# Altium schematic sheet ECG_NEMO_final.schdoc
size A2
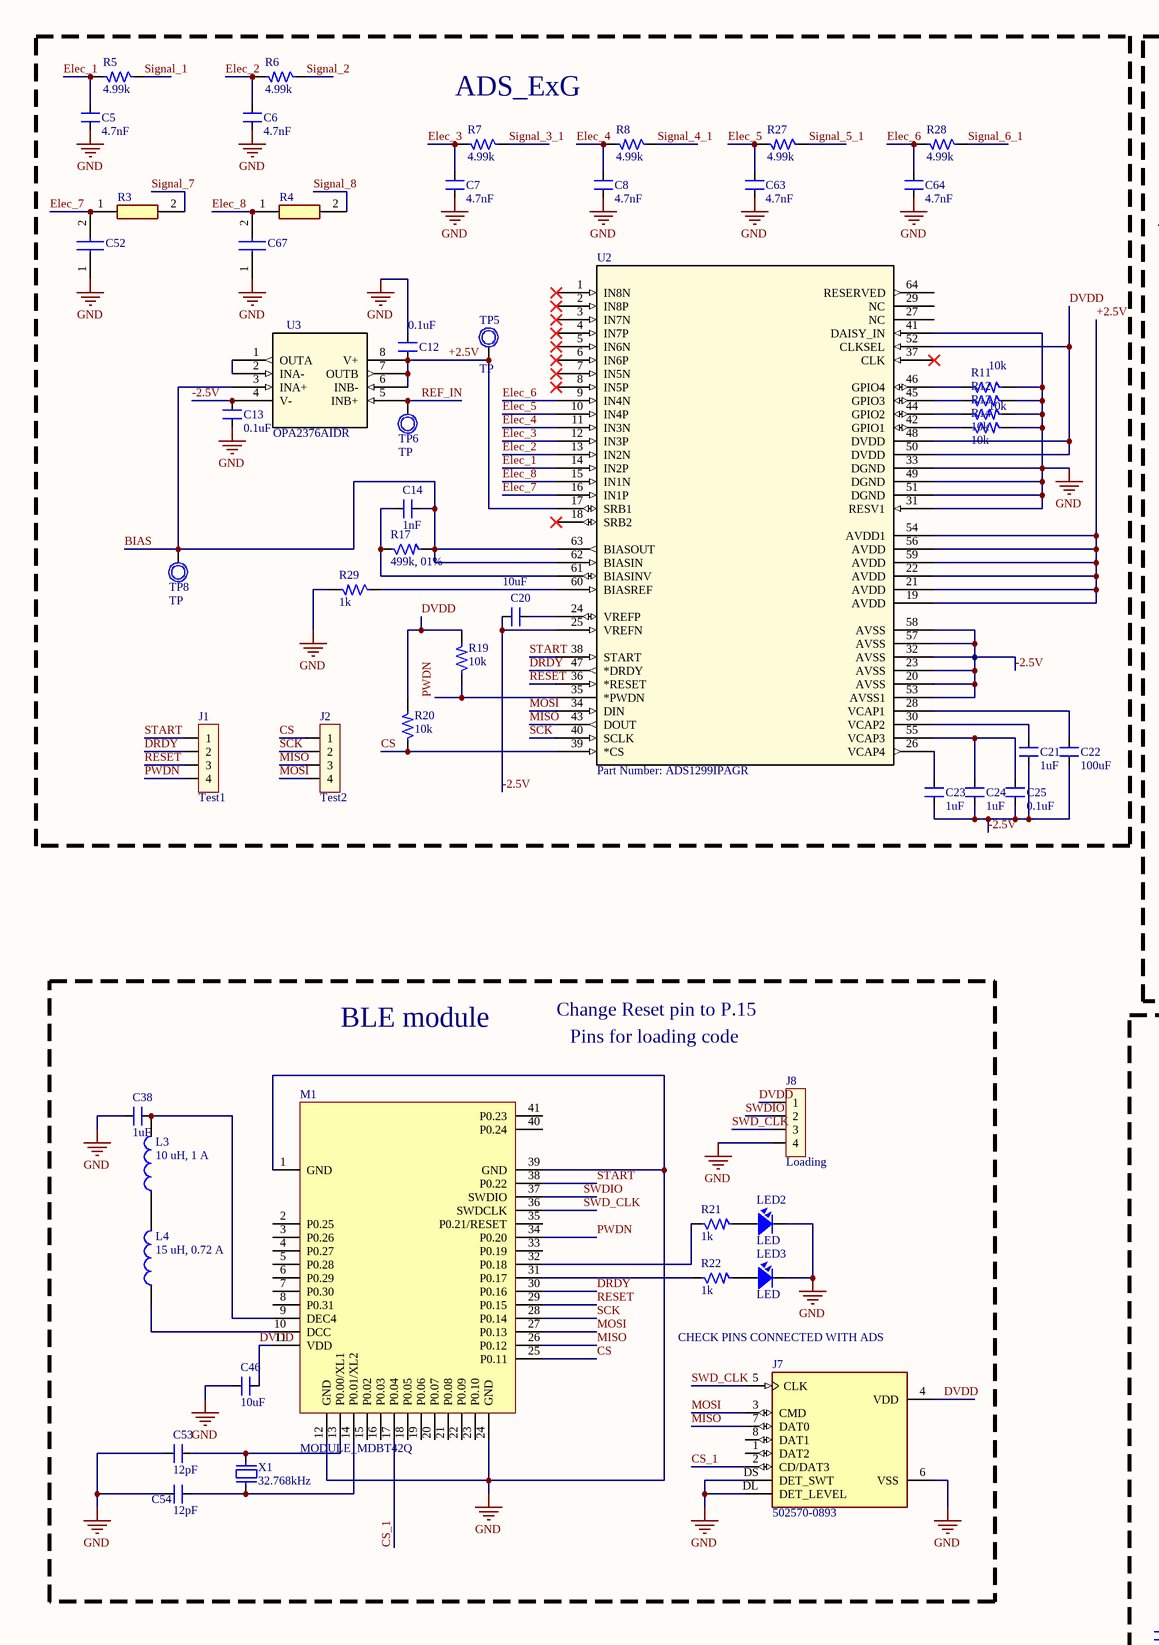
[diagram p0: ECG_NEMO_final.schdoc, left]
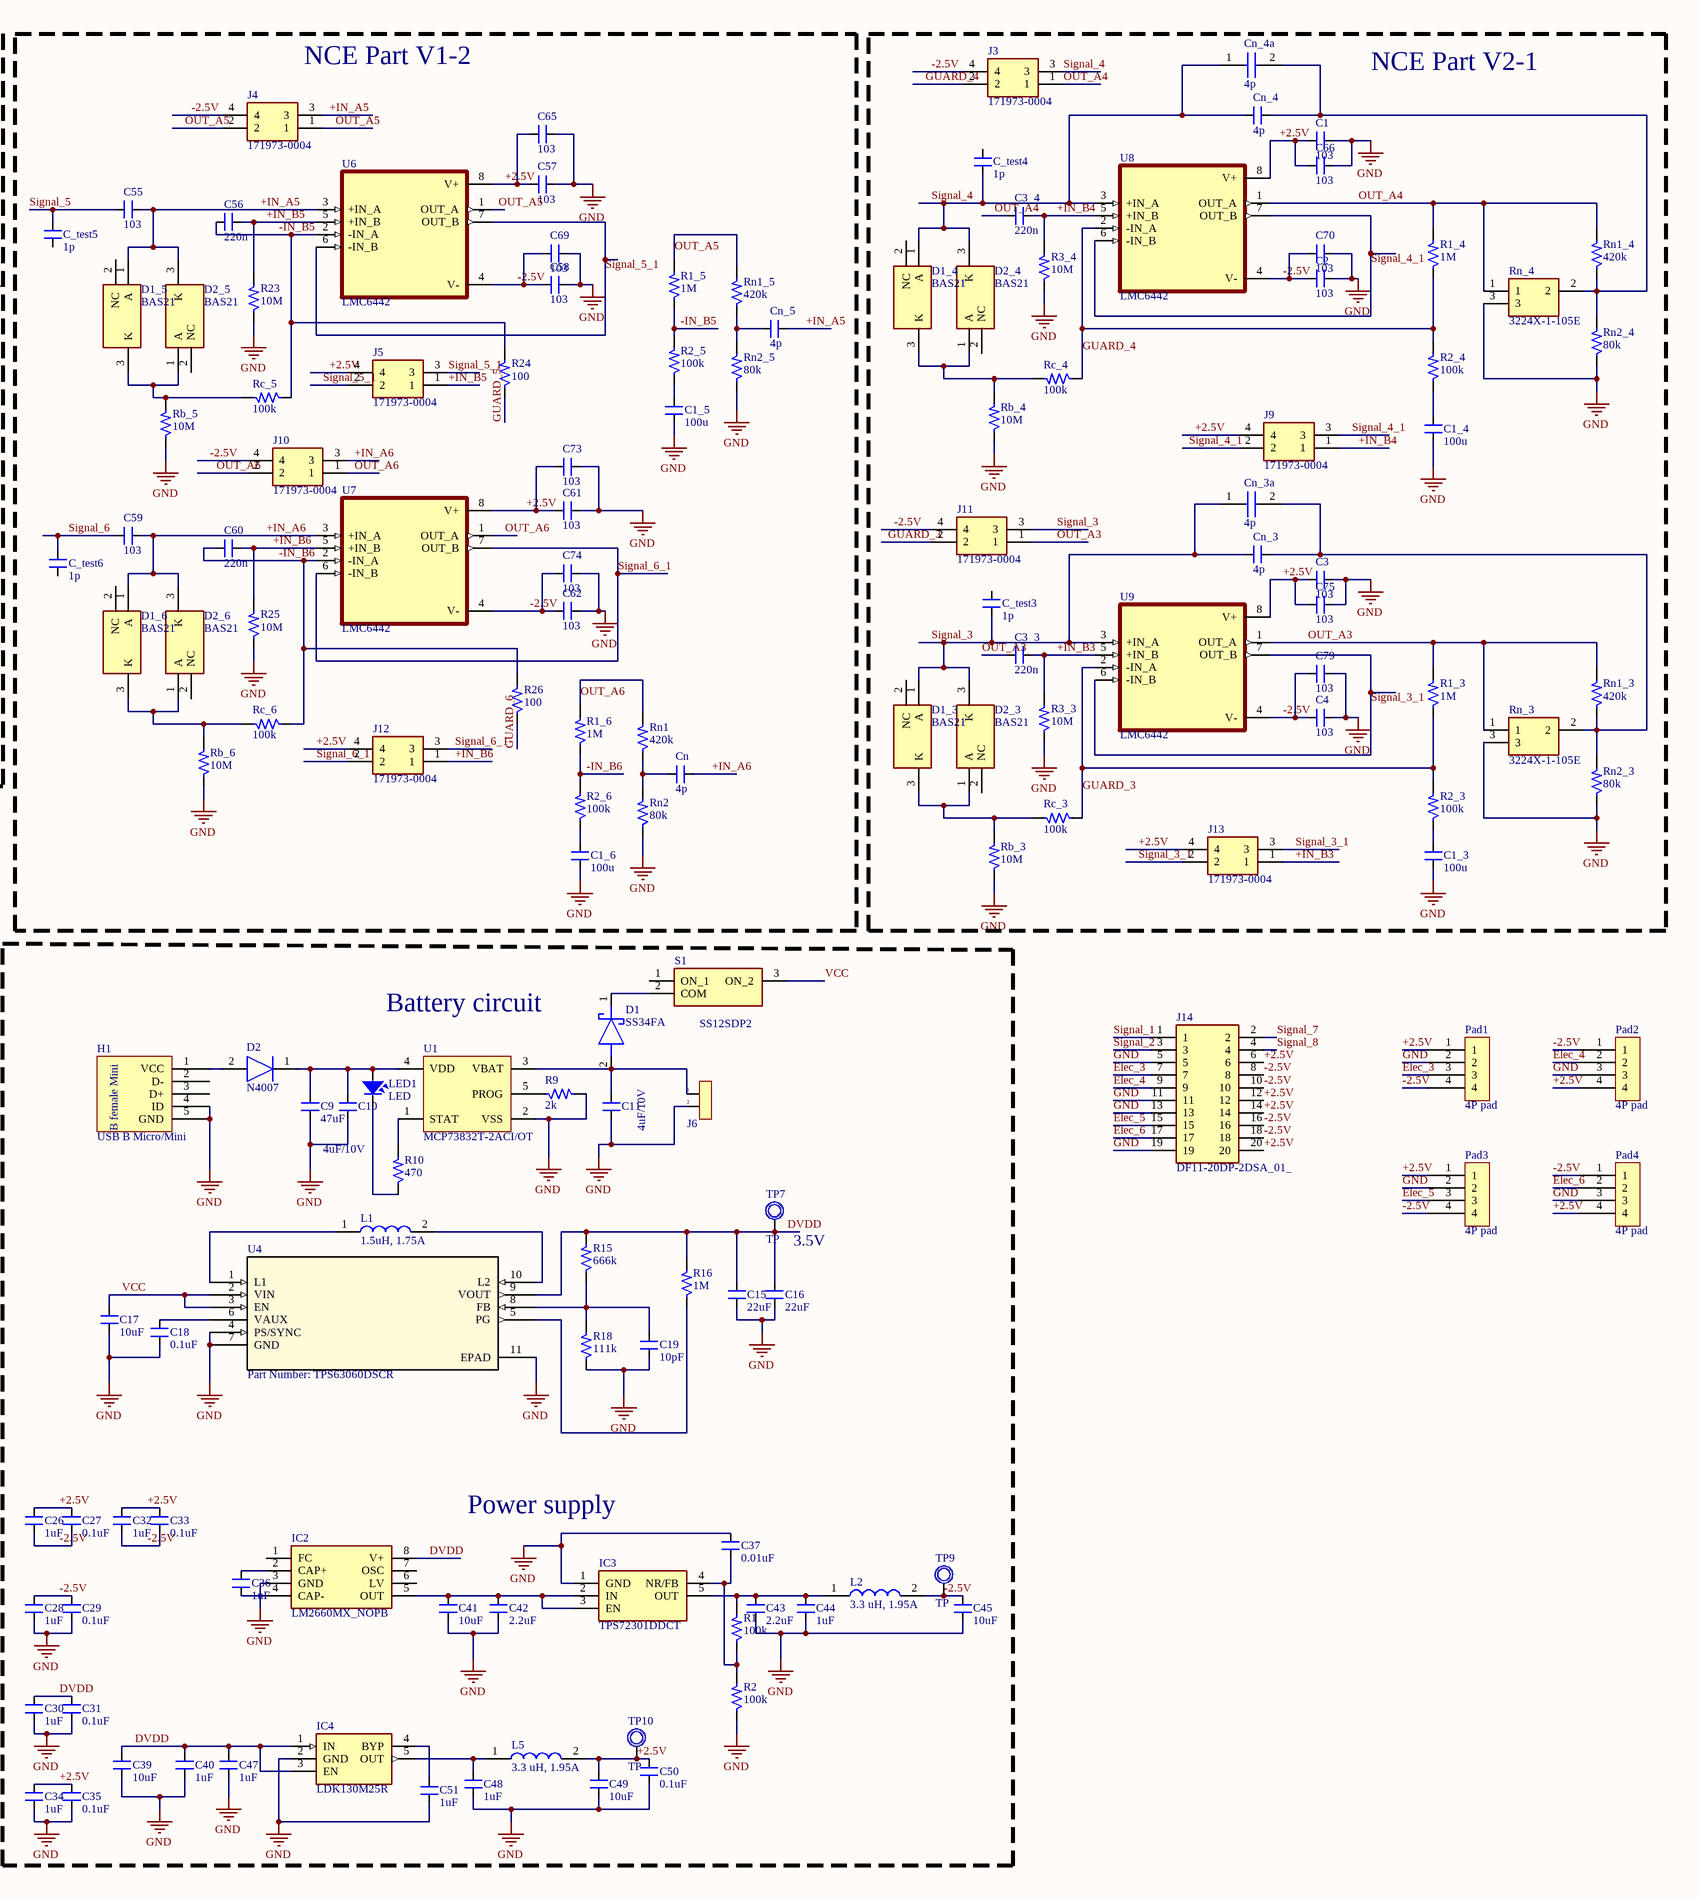
[diagram p1: ECG_NEMO_final.schdoc, right]

## Parts
C1  103  [SM-0805]
C1_3  100u  [SM-0805]
C1_4  100u  [SM-0805]
C1_5  100u  [SM-0805]
C1_6  100u  [SM-0805]
C2  103  [SM-0805]
C3  103  [SM-0805]
C3_3  220n  [SM-0805]
C3_4  220n  [SM-0805]
C4  103  [SM-0805]
C5  4.7nF  [SM-0805]
C6  4.7nF  [SM-0805]
C7  4.7nF  [SM-0805]
C8  4.7nF  [SM-0805]
C9  47uF  [SM-0805]
C10  4uF/10V  [SM-0805]
C11  4uF/10V  [SM-0805]
C12  0.1uF  [SM-0805]
C13  0.1uF  [SM-0805]
C14  1nF  [SM-0805]
C15  22uF  [SM-0805]
C16  22uF  [SM-0805]
C17  10uF  [SM-0805]
C18  0.1uF  [SM-0805]
C19  10pF  [SM-0805]
C20  10uF  [SM-0805]
C21  1uF  [SM-0805]
C22  100uF  [SM-0805]
C23  1uF  [SM-0805]
C24  1uF  [SM-0805]
C25  0.1uF  [SM-0805]
C26  1uF  [SM-0805]
C27  0.1uF  [SM-0805]
C28  1uF  [SM-0805]
C29  0.1uF  [SM-0805]
C30  1uF  [SM-0805]
C31  0.1uF  [SM-0805]
C32  1uF  [SM-0805]
C33  0.1uF  [SM-0805]
C34  1uF  [SM-0805]
C35  0.1uF  [SM-0805]
C36  1uF  [SM-0805]
C37  0.01uF  [SM-0805]
C38  1uF  [SM-0805]
C39  10uF  [SM-0805]
C40  1uF  [SM-0805]
C41  10uF  [SM-0805]
C42  2.2uF  [SM-0805]
C43  2.2uF  [SM-0805]
C44  1uF  [SM-0805]
C45  10uF  [SM-0805]
C46  10uF  [SM-0805]
C47  1uF  [SM-0805]
C48  1uF  [SM-0805]
C49  10uF  [SM-0805]
C50  0.1uF  [SM-0805]
C51  1uF  [SM-0805]
C52  VJ0805Y472KXAMC  [CAPC2012X145N]  (value not drawn)
C53  12pF  [SM-0805]
C54  12pF  [SM-0805]
C55  103  [SM-0805]
C56  220n  [SM-0805]
C57  103  [SM-0805]
C58  103  [SM-0805]
C59  103  [SM-0805]
C60  220n  [SM-0805]
C61  103  [SM-0805]
C62  103  [SM-0805]
C63  4.7nF  [SM-0805]
C64  4.7nF  [SM-0805]
C65  103  [SM-0805]
C66  103  [SM-0805]
C67  VJ0805Y472KXAMC  [CAPC2012X145N]  (value not drawn)
C69  103  [SM-0805]
C70  103  [SM-0805]
C73  103  [SM-0805]
C74  103  [SM-0805]
C75  103  [SM-0805]
C79  103  [SM-0805]
C_test3  1p  [SM-0805]
C_test4  1p  [SM-0805]
C_test5  1p  [SM-0805]
C_test6  1p  [SM-0805]
Cn  4p  [SM-0805]
Cn_3  4p  [SM-0805]
Cn_3a  4p  [JZ100]
Cn_4  4p  [SM-0805]
Cn_4a  4p  [JZ100]
Cn_5  4p  [SM-0805]
D1  SS34FA  [SODFL3618X143N]
D1_3  BAS21  [SOT95P240X120-3N]
D1_4  BAS21  [SOT95P240X120-3N]
D1_5  BAS21  [SOT95P240X120-3N]
D1_6  BAS21  [SOT95P240X120-3N]
D2  N4007  [DIOM5025X220N]
D2_3  BAS21  [SOT95P240X120-3N]
D2_4  BAS21  [SOT95P240X120-3N]
D2_5  BAS21  [SOT95P240X120-3N]
D2_6  BAS21  [SOT95P240X120-3N]
H1  USB B Micro/Mini  [USB-B-MICRO-female Tai02]
IC2  LM2660MX_NOPB  [SOIC127P600X175-8N]
IC3  TPS72301DDCT  [SOT95P280X110-5N]
IC4  LDK130M25R  [SOT95P280X145-5N]
J1  Test1  [sip4]
J2  Test2  [sip4]
J3  171973-0004  [1719730004]
J4  171973-0004  [1719730004]
J5  171973-0004  [1719730004]
J6  Jumper 2  [J2_Jst SH_1mm]  (value not drawn)
J7  502570-0893  [MOLEX_502570-0893]
J8  Loading  [sip4]
J9  171973-0004  [1719730004]
J10  171973-0004  [1719730004]
J11  171973-0004  [1719730004]
J12  171973-0004  [1719730004]
J13  171973-0004  [1719730004]
J14  DF11-20DP-2DSA_01_  [20P 2.5mm]
L1  1.5uH, 1.75A  [WE-TPC_381692]
L2  3.3 uH, 1.95A  [WE-TPC_4818/482892]
L3  10 uH, 1 A  [WE-TPC_2828]
L4  15 uH, 0.72 A  [WE-TPC_2828]
L5  3.3 uH, 1.95A  [WE-TPC_4818/482892]
LED1  LED  [SM-0805]
LED2  LED  [led0805]
LED3  LED  [led0805]
M1  MODULE_MDBT42Q  [PCB_MDBT42Q_10X16]
Pad1  4P pad  [04P 2.5mm]
Pad2  4P pad  [04P 2.5mm]
Pad3  4P pad  [04P 2.5mm]
Pad4  4P pad  [04P 2.5mm]
R1  100k  [SM-0805]
R1_3  1M  [SM-0805]
R1_4  1M  [SM-0805]
R1_5  1M  [SM-0805]
R1_6  1M  [SM-0805]
R2  100k  [SM-0805]
R2_3  100k  [SM-0805]
R2_4  100k  [SM-0805]
R2_5  100k  [SM-0805]
R2_6  100k  [SM-0805]
R3  ERJ-HP6D4991V  [ERJHP6D1000V]  (value not drawn)
R3_3  10M  [SM-0805]
R3_4  10M  [SM-0805]
R4  ERJ-HP6D4991V  [ERJHP6D1000V]  (value not drawn)
R5  4.99k  [SM-0805]
R6  4.99k  [SM-0805]
R7  4.99k  [SM-0805]
R8  4.99k  [SM-0805]
R9  2k  [SM-0805]
R10  470  [SM-0805]
R11  10k  [SM-0805]
R12  10k  [SM-0805]
R13  10k  [SM-0805]
R14  10k  [SM-0805]
R15  666k  [SM-0805]
R16  1M  [SM-0805]
R17  499k, 01%  [SM-0805]
R18  111k  [SM-0805]
R19  10k  [SM-0805]
R20  10k  [SM-0805]
R21  1k  [SM-0805]
R22  1k  [SM-0805]
R23  10M  [SM-0805]
R24  100  [SM-0805]
R25  10M  [SM-0805]
R26  100  [SM-0805]
R27  4.99k  [SM-0805]
R28  4.99k  [SM-0805]
R29  1k  [SM-0805]
Rb_3  10M  [SM-0805]
Rb_4  10M  [SM-0805]
Rb_5  10M  [SM-0805]
Rb_6  10M  [SM-0805]
Rc_3  100k  [SM-0805]
Rc_4  100k  [SM-0805]
Rc_5  100k  [SM-0805]
Rc_6  100k  [SM-0805]
Rn1  420k  [SM-0805]
Rn1_3  420k  [SM-0805]
Rn1_4  420k  [SM-0805]
Rn1_5  420k  [SM-0805]
Rn2  80k  [SM-0805]
Rn2_3  80k  [SM-0805]
Rn2_4  80k  [SM-0805]
Rn2_5  80k  [SM-0805]
Rn_3  3224X-1-105E  [3224X1502E]
Rn_4  3224X-1-105E  [3224X1502E]
S1  SS12SDP2  [SS12SDP2]
TP5  TP  [TP1]
TP6  TP  [TP1]
TP7  TP  [TP1]
TP8  TP  [TP1]
TP9  TP  [TP1]
TP10  TP  [TP1]
U1  MCP73832T-2ACI/OT  [SOT-23-OT5_N]
U2  Part Number: ADS1299IPAGR  [QFP50P1200X1200X120-64N]
U3  OPA2376AIDR  [D8]
U4  Part Number: TPS63060DSCR  [DSC10_1P70X2P15]
U6  LMC6442  [SOIC127P599X175-8N]
U7  LMC6442  [SOIC127P599X175-8N]
U8  LMC6442  [SOIC127P599X175-8N]
U9  LMC6442  [SOIC127P599X175-8N]
X1  32.768kHz  [Crystal 32.768kHz SMD]

## Blocks framed on the sheet
ADS_ExG: C5-C8 C12-C14 C20-C25 C52 C63 C64 C67 J1 J2 R3-R8 R11-R14 R17 R19 R20 R27-R29 TP5 TP6 TP8 U2 U3
NCE Part V1-2: C1_5 C1_6 C55-C62 C65 C69 C73 C74 C_test5 C_test6 Cn Cn_5 D1_5 D1_6 D2_5 D2_6 J4 J5 J10 J12 R1_5 R1_6 R2_5 R2_6 R23-R26 Rb_5 Rb_6 Rc_5 Rc_6 Rn1 Rn1_5 Rn2 Rn2_5 U6 U7
NCE Part V2-1: C1 C1_3 C1_4 C2 C3 C3_3 C3_4 C4 C66 C70 C75 C79 C_test3 C_test4 Cn_3 Cn_3a Cn_4 Cn_4a D1_3 D1_4 D2_3 D2_4 J3 J9 J11 J13 R1_3 R1_4 R2_3 R2_4 R3_3 R3_4 Rb_3 Rb_4 Rc_3 Rc_4 Rn1_3 Rn1_4 Rn2_3 Rn2_4 Rn_3 Rn_4 U8 U9
BLE module: C38 C46 C53 C54 J7 J8 L3 L4 LED2 LED3 M1 R21 R22 X1

## Nets
GND: C1.1 C1_3.2 C1_4.2 C1_5.2 C1_6.2 C2.1 C3.1 C4.1 C5.1 C6.1 C7.1 C8.1 C9.1 C10.1 C11.1 C12.2 C13.1 C15.1 C16.1 C17.1 C18.1 C19.1 C28.1 C29.1 C30.1 C31.1 C34.1 C35.1 C37.2 C38.1 C39.1 C40.1 C41.1 C42.1 C43.1 C44.1 C45.1 C46.1 C47.1 C48.1 C49.1 C50.1 C51.1 C52.1 C53.1 C54.1 C57.1 C58.1 C61.1 C62.1 C63.1 C64.1 C65.1 C66.1 C67.1 C69.1 C70.1 C73.1 C74.1 C75.1 C79.1 H1.4(ID) H1.5(GND) IC2.3(GND) IC3.1(GND) IC4.2(GND) J6.2 J7.6(VSS) J7.DL(DET_LEVEL) J7.DS(DET_SWT) J8.4 J14.5 J14.11 J14.13 J14.19 LED2.K LED3.K M1.1(GND) M1.12(GND) M1.24(GND) M1.39(GND) Pad1.2 Pad2.3 Pad3.2 Pad4.3 R2.1 R3_3.1 R3_4.1 R9.2 R11.2 R12.2 R13.2 R14.2 R18.1 R23.1 R25.1 R29.2 Rb_3.1 Rb_4.1 Rb_5.1 Rb_6.1 Rn2.1 Rn2_3.1 Rn2_4.1 Rn2_5.1 Rn_3.3 Rn_4.3 U1.2(VSS) U2.31(RESV1) U2.33(DGND) U2.41(DAISY_IN) U2.49(DGND) U2.51(DGND) U4.4(PS/SYNC) U4.7(GND) U4.11(EPAD)
+2.5V: C1.2 C3.2 C12.1 C26.2 C27.2 C32.2 C33.2 C34.2 C35.2 C49.2 C50.2 C57.2 C61.2 C65.2 C66.2 C73.2 C75.2 J5.4 J9.4 J12.4 J13.4 J14.6 J14.12 J14.14 J14.20 L5.2 Pad1.1 Pad2.4 Pad3.1 Pad4.4 TP5.1 TP10.1 U2.17(SRB1) U2.19(AVDD) U2.21(AVDD) U2.22(AVDD) U2.54(AVDD1) U2.56(AVDD) U2.59(AVDD) U3.6(INB-) U3.7(OUTB) U3.8(V+) U6.8(V+) U7.8(V+) U8.8(V+) U9.8(V+)
+IN_A5: C55.2 Cn_5.2 D1_5.1(A) D2_5.3(K) J4.3 U6.3(+IN_A)
+IN_A6: C59.1 Cn.2 D1_6.1(A) D2_6.3(K) J10.3 U7.3(+IN_A)
+IN_B3: C3_3.1 J13.1 R3_3.2 U9.5(+IN_B)
+IN_B4: C3_4.1 J9.1 R3_4.2 U8.5(+IN_B)
+IN_B5: C56.1 J5.1 R23.2 U6.5(+IN_B)
+IN_B6: C60.1 J12.1 R25.2 U7.5(+IN_B)
-2.5V: C2.2 C4.2 C13.2 C20.2 C21.1 C22.2 C23.1 C24.1 C25.1 C26.1 C27.1 C28.2 C29.2 C32.1 C33.1 C45.2 C58.2 C62.2 C69.2 C70.2 C74.2 C79.2 J3.4 J4.4 J10.4 J11.4 J14.8 J14.10 J14.16 J14.18 L2.2 Pad1.4 Pad2.1 Pad3.4 Pad4.1 TP9.1 U2.20(AVSS) U2.23(AVSS) U2.25(VREFN) U2.32(AVSS) U2.53(AVSS1) U2.57(AVSS) U2.58(AVSS) U3.4(V-) U6.4(V-) U7.4(V-) U8.4(V-) U9.4(V-)
-IN_B5: C56.2 R1_5.1 R2_5.2 R24.2 Rc_5.1 U6.2(-IN_A)
-IN_B6: C60.2 R1_6.1 R2_6.2 R26.2 Rc_6.1 U7.2(-IN_A)
BIAS: C14.2 R17.2 TP8.1 U2.62(BIASIN) U2.63(BIASOUT) U3.3(INA+)
CS: J2.1 M1.25(P0.11) R20.1 U2.39(*CS)
CS_1: J7.2(CD/DAT3) M1.17(P0.04)
DRDY: J1.2 M1.30(P0.16) U2.47(*DRDY)
DVDD: C15.2 C16.2 C30.2 C31.2 C39.2 C40.2 C46.2 C47.2 IC2.8(V+) IC4.1(IN) IC4.3(EN) J7.4(VDD) J8.1 M1.11(VDD) R15.2 R16.2 R19.2 R20.2 TP7.1 U2.48(DVDD) U2.50(DVDD) U2.52(CLKSEL) U4.9(VOUT)
Elec_1: C5.2 R5.2 U2.14(IN2P)
Elec_2: C6.2 R6.2 U2.13(IN2N)
Elec_3: C7.2 J14.7 Pad1.3 R7.2 U2.12(IN3P)
Elec_4: C8.2 J14.9 Pad2.2 R8.2 U2.11(IN3N)
Elec_5: C63.2 J14.15 Pad3.3 R27.2 U2.10(IN4P)
Elec_6: C64.2 J14.17 Pad4.2 R28.2 U2.9(IN4N)
Elec_7: C52.2 R3.1 U2.16(IN1P)
Elec_8: C67.2 R4.1 U2.15(IN1N)
GUARD_3: J11.2 R1_3.1 R2_3.2 Rc_3.1 U9.2(-IN_A)
GUARD_4: J3.2 R1_4.1 R2_4.2 Rc_4.1 U8.2(-IN_A)
GUARD_5: R24.1
GUARD_6: R26.1
MISO: J2.3 J7.7(DAT0) M1.26(P0.12) U2.43(DOUT)
MOSI: J2.4 J7.3(CMD) M1.27(P0.13) U2.34(DIN)
OUT_A3: C3_3.2 J11.1 R1_3.2 Rn1_3.2 Rn_3.1 U9.1(OUT_A)
OUT_A4: C3_4.2 J3.1 R1_4.2 Rn1_4.2 Rn_4.1 U8.1(OUT_A)
OUT_A5: J4.1 J4.2 R1_5.2 Rn1_5.2 U6.1(OUT_A)
OUT_A6: J10.1 J10.2 R1_6.2 Rn1.2 U7.1(OUT_A)
PWDN: J1.4 M1.34(P0.20) R19.1 U2.35(*PWDN)
REF_IN: TP6.1 U3.5(INB+)
RESET: J1.3 M1.29(P0.15) U2.36(*RESET)
SCK: J2.2 M1.28(P0.14) U2.40(SCLK)
Signal_1: J14.1 R5.1
Signal_2: J14.3 R6.1
Signal_3: C_test3.1 Cn_3.2 Cn_3a.1 D1_3.1(A) D2_3.3(K) J11.3 U9.3(+IN_A)
Signal_3_1: J13.2 J13.3 R7.1 U9.6(-IN_B) U9.7(OUT_B)
Signal_4: C_test4.1 Cn_4.2 Cn_4a.1 D1_4.1(A) D2_4.3(K) J3.3 U8.3(+IN_A)
Signal_4_1: J9.2 J9.3 R8.1 U8.6(-IN_B) U8.7(OUT_B)
Signal_5: C55.1 C_test5.2
Signal_5_1: J5.2 J5.3 R27.1 U6.6(-IN_B) U6.7(OUT_B)
Signal_6: C59.2 C_test6.2
Signal_6_1: J12.2 J12.3 R28.1 U7.6(-IN_B) U7.7(OUT_B)
Signal_7: J14.2 R3.2
Signal_8: J14.4 R4.2
START: J1.1 M1.38(P0.22) U2.38(START)
SWD_CLK: J7.5(CLK) J8.3 M1.36(SWDCLK)
SWDIO: J8.2 M1.37(SWDIO)
VCC: C17.2 S1.3(ON_2) U4.2(VIN) U4.3(EN)
NetC1_3_1: C1_3.1 R2_3.1
NetC1_4_1: C1_4.1 R2_4.1
NetC1_5_1: C1_5.1 R2_5.1
NetC1_6_1: C1_6.1 R2_6.1
NetC9_2: C9.2 C10.2 D2.1(K) LED1.1 U1.4(VDD)
NetC11_2: C11.2 D1.2(A) J6.1 U1.3(VBAT)
NetC14_1: C14.1 R17.1 U2.61(BIASINV)
NetC18_2: C18.2 U4.6(VAUX)
NetC19_2: C19.2 R15.1 R18.2 U4.8(FB)
NetC20_1: C20.1 U2.24(VREFP)
NetC21_2: C21.2 U2.30(VCAP2)
NetC22_1: C22.1 U2.28(VCAP1)
NetC23_2: C23.2 U2.26(VCAP4)
NetC24_2: C24.2 C25.2 U2.55(VCAP3)
NetC36_1: C36.1 IC2.2(CAP+)
NetC36_2: C36.2 IC2.4(CAP-)
NetC37_1: C37.1 IC3.4(NR/FB) R1.1 R2.2
NetC38_2: C38.2 L3.2 M1.9(DEC4)
NetC41_2: C41.2 C42.2 IC2.5(OUT) IC3.2(IN) IC3.3(EN)
NetC43_2: C43.2 C44.2 IC3.5(OUT) L2.1 R1.2
NetC48_2: C48.2 IC4.5(OUT) L5.1
NetC51_2: C51.2 IC4.4(BYP)
NetC53_2: C53.2 M1.13(P0.00/XL1) X1.2
NetC54_2: C54.2 M1.14(P0.01/XL2) X1.1
NetCn_1: Cn.1 Rn1.1 Rn2.2
NetCn_3_1: Cn_3.1 Cn_3a.2 Rn1_3.1 Rn2_3.2 Rn_3.2
NetCn_4_1: Cn_4.1 Cn_4a.2 Rn1_4.1 Rn2_4.2 Rn_4.2
NetCn_5_1: Cn_5.1 Rn1_5.1 Rn2_5.2
NetD1_1: D1.1(K) S1.2(COM)
NetD1_3_3: D1_3.3(K) D2_3.1(A) Rb_3.2 Rc_3.2
NetD1_4_3: D1_4.3(K) D2_4.1(A) Rb_4.2 Rc_4.2
NetD1_5_3: D1_5.3(K) D2_5.1(A) Rb_5.2 Rc_5.2
NetD1_6_3: D1_6.3(K) D2_6.1(A) Rb_6.2 Rc_6.2
NetD2_2: D2.2(A) H1.1(VCC)
NetL1_1: L1.1 U4.1(L1)
NetL1_2: L1.2 U4.10(L2)
NetL3_1: L3.1 L4.2
NetL4_1: L4.1 M1.10(DCC)
NetLED1_2: LED1.2 R10.1
NetLED2_A: LED2.A R21.2
NetLED3_A: LED3.A R22.2
NetM1_31: M1.31(P0.17) R22.1
NetM1_32: M1.32(P0.18) R21.1
NetR9_1: R9.1 U1.5(PROG)
NetR10_2: R10.2 U1.1(STAT)
NetR11_1: R11.1 U2.46(GPIO4)
NetR12_1: R12.1 U2.45(GPIO3)
NetR13_1: R13.1 U2.44(GPIO2)
NetR14_1: R14.1 U2.42(GPIO1)
NetR16_1: R16.1 U4.5(PG)
NetR29_1: R29.1 U2.60(BIASREF)
NetU3_1: U3.1(OUTA) U3.2(INA-)

Not connected (* = marked no-connect by the designer): C_test3 2; C_test4 2; C_test5 1; C_test6 1; D1_3 2(NC); D1_4 2(NC); D1_5 2(NC); D1_6 2(NC); D2_3 2(NC); D2_4 2(NC); D2_5 2(NC); D2_6 2(NC); H1 2(D-) 3(D+); IC2 1(FC) 6(LV) 7(OSC); J7 1(DAT2) 8(DAT1); M1 2(P0.25) 3(P0.26) 4(P0.27) 5(P0.28) 6(P0.29) 7(P0.30) 8(P0.31) 15(P0.02) 16(P0.03) 18(P0.05) 19(P0.06) 20(P0.07) 21(P0.08) 22(P0.09) 23(P0.10) 33(P0.19) 35(P0.21/RESET) 40(P0.24) 41(P0.23); S1 1(ON_1); U2 1(IN8N)* 2(IN8P)* 3(IN7N)* 4(IN7P)* 5(IN6N)* 6(IN6P)* 7(IN5N)* 8(IN5P)* 18(SRB2)* 27(NC) 29(NC) 37(CLK)* 64(RESERVED)

## Notes on the sheet
- Change Reset pin to P.15
- Pins for loading code
- (near D1) Battery circuit
- CHECK PINS CONNECTED WITH ADS
- (near TP7) 3.5V
- Power supply
- Title
- Size:
- Date:
- File:
- A2
- Number:
- Time:
- Revision:
- Sheet
- of
- (in symbol USB B Female Micro/Mini SMD) B female Mini

## Library data of the parts
C1-C4 C57-C59 C61 C62 C65 C66 C69 C70 C73-C75 C79 = CM: Cap SMD; Value: 103
C1_3-C1_6 C3_3 C3_4 C5-C51 C53 C54 C56 C60 C63 C64 Cn Cn_3-Cn_5 = CM: Cap SMD; Value: 103
C52 C67 = VJ0805Y472KXAMC: Capacitor 4.7nF; Manufacturer_Name: Vishay; Datasheet Link: http://www.vishay.com/docs/45226/vj31xrohsautomlcc.pdf; Height: 1.45mm; Manufacturer_Part_Number: VJ0805Y472KXAMC; Mouser Part Number: 77-VJ0805Y472KXAMC; Mouser Price/Stock: https://www.mouser.co.uk/ProductDetail/Vishay-Vitramon/VJ0805Y472KXAMC?qs=17Xm%252BID41ySvUhElOJjluA%3D%3D; Case: 0805 (in); Mounting Style: SMD/SMT
C55 = CM_5: Cap SMD; Value: 103
C_test3-C_test6 = CM_5: Cap SMD; Value: 103
Cn_3a Cn_4a = JZ100: Capacitor; Manufacturer_Name: Knowles; Datasheet Link: https://www.knowlescapacitors.com/getattachment/4e3ef37f-1910-4b01-89e4-302e57c70f90/JZ-Series.aspx; Height: 1.45mm; Manufacturer_Part_Number: JZ100; Mouser Part Number: 768-JZ100
D1 = SS34FA: Schottky Diode; Manufacturer_Name: ON Semiconductor; Datasheet Link: https://componentsearchengine.com/Datasheets/1/SS34FA.pdf; Height: 1.43mm; Mouser Part Number: 512-SS34FA; Mouser Price/Stock: https://www.mouser.com/Search/Refine.aspx?Keyword=512-SS34FA; Manufacturer_Part_Number: SS34FA
D1_3-D1_6 D2_3-D2_6 = BAS21: Diode; Manufacturer_Name: onsemi; Datasheet Link: http://www.onsemi.com/pub/Collateral/BAS21-D.pdf; Height: 1.2mm; Manufacturer_Part_Number: BAS21; Mouser Part Number: 512-BAS21; Mouser Price/Stock: https://www.mouser.co.uk/ProductDetail/ON-Semiconductor-Fairchild/BAS21?qs=GXJjH%252BIVz3MgJ%252Bf2%252BjymzQ%3D%3D; Arrow Part Number: BAS21; Arrow Price/Stock: https://www.arrow.com/en/products/bas21/on-semiconductor
D2 = EC11FS2: Diode; Manufacturer_Name: KYOCERA; Datasheet Link: https://www.mouser.jp/datasheet/2/909/EC11FS2-file-1588983.pdf; Height: 2.2mm; Mouser Part Number: 346-EC11FS2; Manufacturer_Part_Number: EC11FS2
H1 = USB B Female Micro/Mini SMD
IC2 = LM2660MX_NOPB: Integrated Circuit; Manufacturer_Name: Texas Instruments; Manufacturer_Part_Number: LM2660MX NOPB; Datasheet Link: https://www.ti.com/lit/ds/symlink/lm2660.pdf?ts=1636191506646&ref_url=https%253A%252F%252Fwww.ti.com%252Fstore%252Fti%252Fen%252Fp%252Fproduct%252F%253Fp%253DLM2660MX%252FNOPB; Height: 1.75mm; Arrow Part Number: LM2660MX NOPB; Arrow Price/Stock: https://www.arrow.com/en/products/lm2660mxnopb/texas-instruments
IC3 = TPS72301DDCT: Integrated Circuit; Manufacturer_Name: Texas Instruments; Datasheet Link: http://www.ti.com/lit/gpn/TPS723; Height: 1.1mm; Manufacturer_Part_Number: TPS72301DDCT; Mouser Part Number: 595-TPS72301DDCT; Mouser Price/Stock: https://www.mouser.co.uk/ProductDetail/Texas-Instruments/TPS72301DDCT?qs=7z%252BmIopC6%2FL7xVbTZrmV7g%3D%3D; Arrow Part Number: TPS72301DDCT; Arrow Price/Stock: https://www.arrow.com/en/products/tps72301ddct/texas-instruments?region=nac
IC4 = LDK130M25R: Integrated Circuit; Manufacturer_Name: STMicroelectronics; Datasheet Link: http://www.st.com/web/en/resource/technical/document/datasheet/DM00076097.pdf; Height: 1.45mm; Manufacturer_Part_Number: LDK130M25R; Mouser Part Number: 511-LDK130M25R; Mouser Price/Stock: https://www.mouser.com/Search/Refine.aspx?Keyword=511-LDK130M25R; Arrow Part Number: LDK130M25R; Arrow Price/Stock: https://www.arrow.com/en/products/ldk130m25r/stmicroelectronics
J1 J2 J8 = JP4: Connector 4; Value: Connector 4x2
J3-J5 J9-J13 = 171973-0004: Connector; Manufacturer_Name: Molex; Datasheet Link: https://www.molex.com/pdm_docs/sd/1719730004_sd.pdf; Height: 11.8mm; Manufacturer_Part_Number: 171973-0004; Mouser Part Number: 538-171973-0004; Mouser Price/Stock: https://www.mouser.co.uk/ProductDetail/Molex/171973-0004?qs=lc2O%252BfHJPVaHyBdhjsB7Nw%3D%3D; Arrow Part Number: 171973-0004; Arrow Price/Stock: https://www.arrow.com/en/products/1719730004/molex?region=europe
J6 = JP 2: Value: JP 2
J7 = 502570-0893: 10 _8 + 2_ Position Card Connector Secure Digital - microSDâ„¢ Surface Mount, Right Angle Gold; MF: Molex; Price: None; Package: None; Value: *; MP: 502570-0893; Availability: Unavailable; SnapEDA_Link: https://www.snapeda.com/parts/502570-0893/Molex/view-part/225170/?ref=snap
J14 = DF11-20DP-2DSA_01_: Connector; Manufacturer_Name: Hirose; Manufacturer_Part_Number: DF11-20DP-2DSA(01); Datasheet Link: https://www.hirose.com/en/product/document?clcode=CL0543-0525-3-01&productname=DF11-20DP-2DSA(01)&series=DF11&documenttype=2DDrawing&lang=en&documentid=0000995343; Height: 7.1mm; Mouser Part Number: 798-DF11-20DP-2DSA01; Mouser Price/Stock: https://www.mouser.co.uk/ProductDetail/Hirose-Connector/DF11-20DP-2DSA01?qs=Ux3WWAnHpjAvHkbqZ9K7Yg%3D%3D
L1 = 744031001: Inductor; Manufacturer_Name: Wurth Elektronik; Manufacturer_Part_Number: 744031001; Mouser Part Number: 710-744031001; Mouser Price/Stock: https://www.mouser.co.uk/ProductDetail/Wurth-Elektronik/744031001?qs=PGXP4M47uW5omdHfp5PCig%3D%3D
L2 L5 = 744042003: Inductor; Manufacturer_Name: Wurth Elektronik; Manufacturer_Part_Number: 744042003; Mouser Part Number: 710-744042003; Mouser Price/Stock: https://www.mouser.co.uk/ProductDetail/Wurth-Elektronik/744042003?qs=PGXP4M47uW67fekbtUi6HQ%3D%3D
L3 = 744025100: SMT Shielded Tiny Power Inductor WE-TPC, size 2828, 10 uH, 1 A; Rated Current: 1 A; Inductance: 10 uH; DC Resistance max.: 190 mOhm; Self Resonant Frequency: 41 MHz; Saturation Current: 1.1 A; ComponentLink1Description: Manufacturer; ComponentLink1URL: http://www.we-online.de; ComponentLink2Description: Datasheet; ComponentLink2URL: https://katalog.we-online.com/pbs/datasheet/744025100.pdf; Part Number: 744025100; Published Date: December 2018; Publisher: Wurth Elektronik; Size: 2828; Operating Temperature: -40 to +125 degC; Mounting Technology: SMT; Packaging: Tape and Reel
L4 = 744025150: SMT Shielded Tiny Power Inductor WE-TPC, size 2828, 15 uH, 0.72 A; Rated Current: 0.72 A; Inductance: 15 uH; DC Resistance max.: 400 mOhm; Self Resonant Frequency: 32 MHz; Saturation Current: 0.9 A; ComponentLink1Description: Manufacturer; ComponentLink1URL: http://www.we-online.de; ComponentLink2Description: Datasheet; ComponentLink2URL: https://katalog.we-online.com/pbs/datasheet/744025150.pdf; Part Number: 744025150; Published Date: December 2018; Publisher: Wurth Elektronik; Size: 2828; Operating Temperature: -40 to +125 degC; Mounting Technology: SMT; Packaging: Tape and Reel
LED1-LED3 = LED: LED Single colour Green and Red; Value: LED 3 ly Single Colour
M1 = MODULE_MDBT42Q: MDBT42Q
R1 R1_3-R1_6 R2 R2_3-R2_6 R3_3 R3_4 R5-R29 Rb_3-Rb_6 Rc_3-Rc_6 Rn1 Rn1_3-Rn1_5 Rn2 Rn2_3-Rn2_5 = R: Resistor 1/4W; Value: R1/4W - 1K
R3 R4 = ERJ-HP6D4991V: Resistor 4.99k; Manufacturer_Name: Panasonic; Datasheet Link: http://industrial.panasonic.com/cdbs/www-data/pdf/RDQ0000/ast-ind-151033.pdf; Height: 0.7mm; Manufacturer_Part_Number: ERJ-HP6D4991V; Case: 0805 (in); Mounting Style: SMD/SMT
Rn_3 Rn_4 = 3224X-1-105E: Resistor; Manufacturer_Name: Bourns; Datasheet Link: https://www.bourns.com/docs/Product-Datasheets/3224.pdf; Height: 5mm; Manufacturer_Part_Number: 3224X-1-105E; Mouser Part Number: 652-3224X-1-105E; Mouser Price/Stock: https://www.mouser.co.uk/ProductDetail/Bourns/3224X-1-105E?qs=tEaODSGlU8OES45Zo8R5qQ%3D%3D; Arrow Part Number: 3224X-1-105E; Arrow Price/Stock: https://www.arrow.com/en/products/3224x-1-105e/bourns?region=nac
S1 = SS12SDP2: Switch; Manufacturer_Name: NKK Switches; Datasheet Link: https://componentsearchengine.com/Datasheets/1/SS12SDP2.pdf; Height: 4mm; Mouser Part Number: 633-SS12SDP2; Mouser Price/Stock: https://www.mouser.com/Search/Refine.aspx?Keyword=633-SS12SDP2; Manufacturer_Part_Number: SS12SDP2
TP5-TP10 = TP1: Test Point; Value: Test Point
U1 = MCP73832T-2ACI/OT: Miniature Single-Cell, Fully Integrated Li-Ion, Li-Polymer Charge Management Controller, 4.2V, 5-Pin SOT-23, Industrial Temperature, Tape and Reel; Published: 29-Jan-2009; LatestRevisionDate: 27-Nov-2009; LatestRevisionNote: Updated to datasheet revision E, Sep-2008; DatasheetVersion: revE, Sep-2008; PackageVersion: revBB, Aug-2009; PackageReference: SOT-23-OT5; Publisher: Altium Limited; PackageDescription: 5-Lead Plastic Small Outline Transistor (OT) [SOT-23]; Supplier 1: Digi-Key; Supplier Part Number 1: MCP73832T-2ACI/OTTR-ND; Supplier 2: Digi-Key; Supplier Part Number 2: MCP73832T-2ACI/OTCT-ND; Supplier 3: Digi-Key; Supplier Part Number 3: MCP73832T-2ACI/OTDKR-ND; Supplier 4: Farnell; Supplier Part Number 4: 1332159; Code_IPC: SOT23-5; ComponentLink1Description: Datasheet; ComponentLink1URL: http://ww1.microchip.com/downloads/en/DeviceDoc/21984e.pdf; ComponentLink2Description: Packaging Specification; ComponentLink2URL: http://www.microchip.com/stellent/groups/techpub_sg/documents/packagingspec/en012702.pdf; ComponentLink3Description: Microchip.com Home; ComponentLink3URL: http://www.microchip.com/
U2 = ADS1299IPAGR: No Description Available; Vendor: Texas Instruments; Built_By: EMA_UL_Team; Manufacturer_Part_Number: ADS1299IPAGR; Copyright: Copyright (C) 2018 Accelerated Designs. All rights reserved; RefDes: RefDes; Type: DEV; Value: Value
U3 = OPA2376AIDR: No Description Available; Vendor: Texas Instruments; Built_By: EMA_UL_Team; Manufacturer_Part_Number: OPA2376AIDR; Copyright: Copyright (C) 2018 Accelerated Designs. All rights reserved; RefDes: RefDes; Type: DEV; Value: Value
U4 = TPS63060DSCR: No Description Available; Vendor: Texas Instruments; Built_By: EMA_UL_Team; Manufacturer_Part_Number: TPS63060DSCR; Manufacturer: Texas Instruments; Copyright: Copyright (C) 2018 Accelerated Designs. All rights reserved; RefDes: RefDes; Type: DEV; Value: Value
U6-U9 = OPA2277U: 10V, 0.1V/?C, High-Precision, Low-Power Operational Amplifier 8-SOIC; MF: Texas Instruments; Value: *; Package: SOIC-8 Texas Instruments; Check_prices: https://www.snapeda.com/parts/OPA2277U/Texas%20Instruments/view-part/9572/?ref=eda; Price: None; MP: OPA2277U; Purchase-URL: https://pricing.snapeda.com/search/part/OPA2277U/?ref=eda; Availability: Good; SnapEDA_Link: https://www.snapeda.com/parts/OPA2277U/Texas%20Instruments/view-part/9572/?ref=snap
X1 = Crystal: Crystal For all Crystal 2pin.; Value: 4Mhz